# Altium schematic sheet USB_UART.SchDoc: USB2UART
size A4; Author: Tien Nguyen; Organization: Gremsy Co., Ltd; Address1: 22 Duong 18, Linh Dong; Address2: Thu Duc District, HCMC; DocumentNumber: 2; Revision: 1.2; SheetNumber: 2; SheetTotal: 5
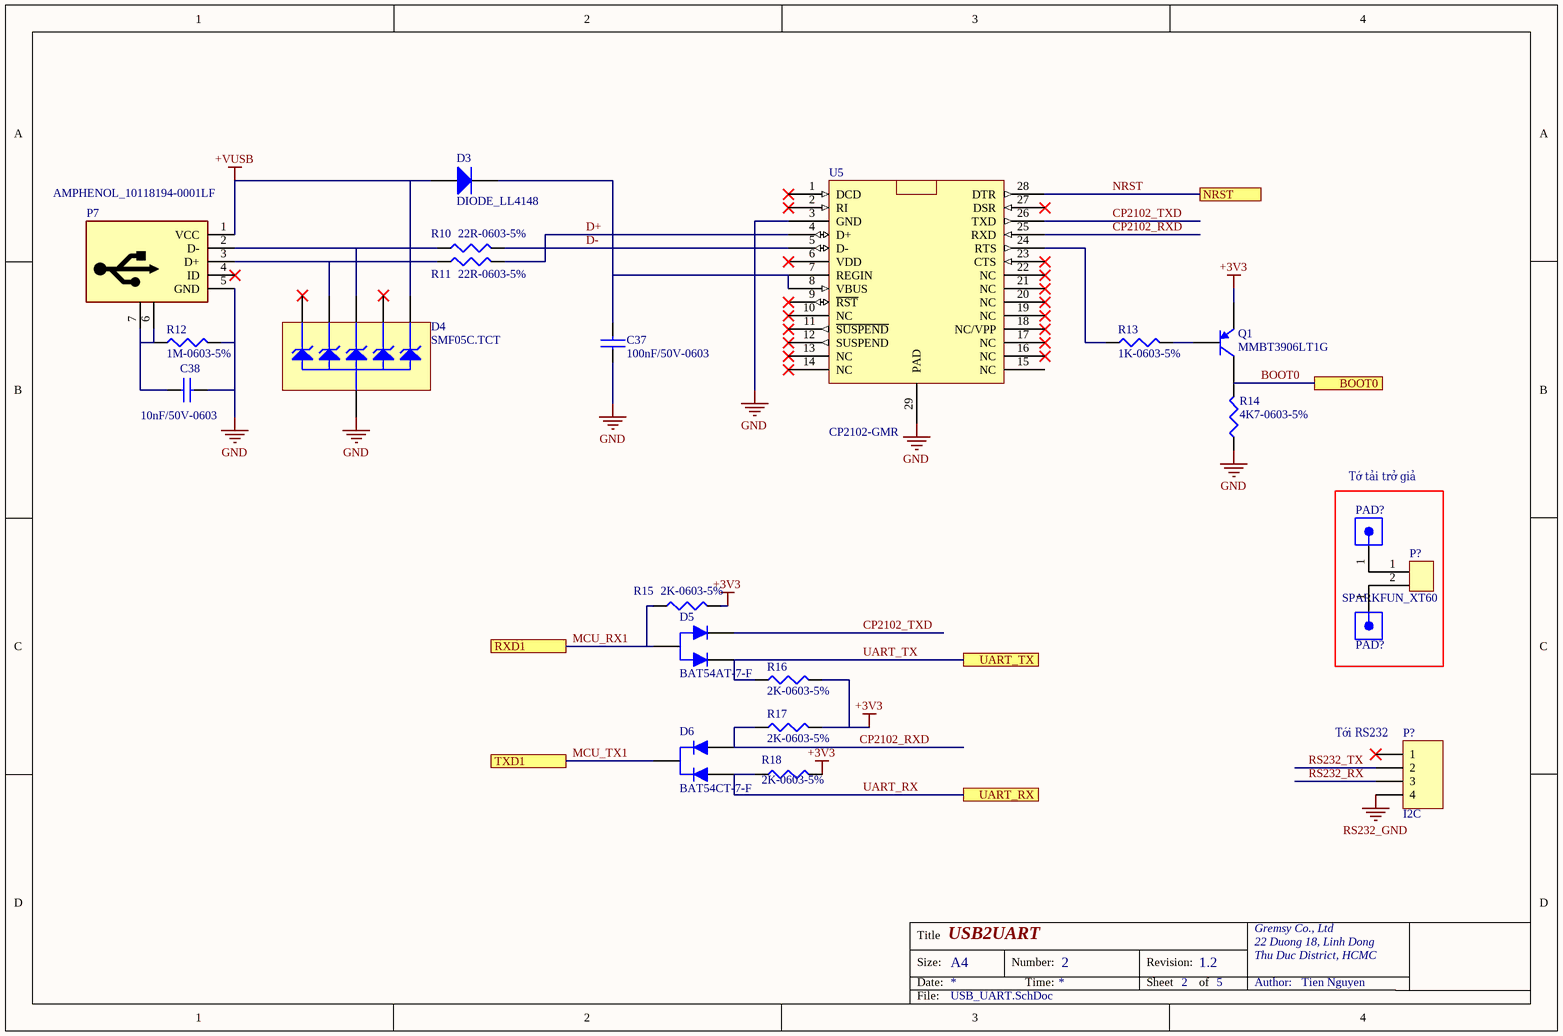
[diagram p0: USB_UART.SchDoc]

## Parts
(Parts that share a designator on the sheet are numbered #1, #2 ... from top to bottom, then left to right.)
C37  100nF/50V-0603  [CAP0603]
C38  10nF/50V-0603  [CAP0603]
D3  DIODE_LL4148  [SOD80]
D4  SMF05C.TCT  [SC-88]
D5  BAT54AT-7-F  [SOT523-3]
D6  BAT54CT-7-F  [SOT523-3]
P7  AMPHENOL_10118194-0001LF  [USB-B-Micro_10118194-0001LF]
P?#1  SPARKFUN_XT60  [XT60_MALE]
P?#2  I2C  [JST_SM04B-GHS-TB(LF)(SN)]
PAD?#1  PAD_2.5MM_1.5MM  [PAD_2.5MM_1.5MM_HOLE]  (value not drawn)  (no BOM)
PAD?#2  PAD_2.5MM_1.5MM  [PAD_2.5MM_1.5MM_HOLE]  (value not drawn)  (no BOM)
Q1  MMBT3906LT1G  [SOT23]
R10  22R-0603-5%  [RES0603]
R11  22R-0603-5%  [RES0603]
R12  1M-0603-5%  [RES0603]
R13  1K-0603-5%  [RES0603]
R14  4K7-0603-5%  [RES0603]
R15  2K-0603-5%  [RES0603]
R16  2K-0603-5%  [RES0603]
R17  2K-0603-5%  [RES0603]
R18  2K-0603-5%  [RES0603]
U5  CP2102-GMR  [QFN28-Pitch 0.5 mm]

## Blocks framed on the sheet
Tớ tải trở giả: P?#1 PAD?#1 PAD?#2

## Ports
BOOT0, NRST, RXD1, TXD1, UART_RX, UART_TX

## Nets
+3V3: Q1.2(E) R15.2 R16.2 R17.2 R18.2
+VUSB: D3.1(A) D4.6 P7.1(VCC)
GND: C37.1 C38.2 D4.2 P7.5(GND) R12.2 R14.1 U5.3(GND) U5.29(PAD)
RS232_GND: P?#2.4
BOOT0: Q1.3(C) R14.2 ; port BOOT0
CP2102_RXD: D6.2(A) R17.1 U5.25(RXD)
CP2102_TXD: D5.2(K) U5.26(TXD)
D+: R11.2 U5.4(D+)
D-: R10.2 U5.5(D-)
MCU_RX1: D5.3(A) R15.1 ; port RXD1
MCU_TX1: D6.3(K) ; port TXD1
NRST: U5.28(DTR) ; port NRST
RS232_RX: P?#2.3
RS232_TX: P?#2.2
UART_RX: D6.1(A) R18.1 ; port UART_RX
UART_TX: D5.1(K) R16.1 ; port UART_TX
NetC37_2: C37.2 D3.2(K) U5.7(REGIN) U5.8(VBUS)
NetC38_1: C38.1 P7.6(SHIELD) P7.7(SHIELD) R12.1
NetD4_3: D4.3 P7.3(D+) R11.1
NetD4_4: D4.4 P7.2(D-) R10.1
NetP?#1_1: P?#1.1 PAD?#1.1
NetP?#1_2: P?#1.2 PAD?#2.1
NetQ1_1: Q1.1(B) R13.2
NetR13_1: R13.1 U5.24(RTS)

Not connected (* = marked no-connect by the designer): D4 1* 5*; P7 4(ID)*; P?#2 1*; U5 1(DCD)* 2(RI)* 6(VDD)* 9(~{RST})* 10(NC)* 11(~{SUSPEND})* 12(SUSPEND)* 13(NC)* 14(NC)* 15(NC) 16(NC)* 17(NC)* 18(NC/VPP)* 19(NC)* 20(NC)* 21(NC)* 22(NC)* 23(CTS)* 27(DSR)*

## Notes on the sheet
- (near P?#2) Tới RS232
- Title
- Size:
- Date:
- A4
- Number:
- Time:
- Revision:
- Sheet
- of
- Author:
- File:

## Library data of the parts
C37 = CAP_100nF/50V-0603-10%: CAP CER 0.1UF 50V X7R 0603; Manufacturer 1: Yageo; MfrP/N: CC0603KRX7R9BB104; Tolerance: ±10%; Value: 100nF; GremsyP/N: 102-100n-005-0; Supplier 1: Digi-Key; Supplier Part Number 1: 311-1344-1-ND; Voltage - Rated: 50V; Package / Case: 0603 (1608 Metric); ComponentLink1URL: http://www.yageo.com/documents/recent/UPY-GPHC_X7R_6.3V-to-50V_18.pdf; ComponentLink1Description: http://www.yageo.com/documents/recent/UPY-GPHC_X7R_6.3V-to-50V_18.pdf
C38 = CAP_10nF/50V-0603-10%: CAP CER 10000PF 50V X7R 0603; Manufacturer 1: Yageo; MfrP/N: CC0603KRX7R9BB103; Tolerance: ±10%; Value: 10nF; GremsyP/N: 102-10n-0030; Supplier 1: Digi-Key; Supplier Part Number 1: 311-1085-1-ND; Voltage - Rated: 50V; Package / Case: 0603 (1608 Metric); ComponentLink1URL: http://www.yageo.com/documents/recent/UPY-GPHC_X7R_6.3V-to-50V_18.pdf; ComponentLink1Description: http://www.yageo.com/documents/recent/UPY-GPHC_X7R_6.3V-to-50V_18.pdf
D3 = DIODE-RECTIFIER_LL4148: DIODE GEN PURP 100V 200MA SOD80; Manufacturer: Fairchild/ON Semiconductor; MfrP/N: LL4148; Diode Type: Standard; Voltage - Forward (Vf) (Max) @ If: 1V @ 10mA; Speed: Small Signal =< 200mA (Io), Any Speed; Current - Reverse Leakage @ Vr: 25nA @ 20V; Capacitance @ Vr, F: 4pF @ 0V, 1MHz; GremsyP/N: 104-RECT-002-0; Supplier 1: Digi-Key; RoHS: RoHS Compliant; Category: Discrete Semiconductor Products; Stock 1: 494912; Pricing 1: 1=0.1, 10=0.095, 100=0.0518, 500=0.03188, 1000=0.02174 (USD); Packaging: Cut Tape (CT); Part Status: Active; Current - Average Rectified (Io): 200mA; Mounting Type: Surface Mount; Package / Case: DO-213AC, MINI-MELF, SOD-80; Supplier Device Package: SOD-80; Operating Temperature - Junction: -55°C ~ 175°C; ComponentLink1URL: https://www.fairchildsemi.com/datasheets/LL/LL4148.pdf; ComponentLink1Description: https://www.fairchildsemi.com/datasheets/LL/LL4148.pdf; Supplier Part Number 1: LL4148FSCT-ND
D4 = DIODE-ESD_SMF05C.TCT: TVS DIODE 5VWM 12.5VC SC70-6; Manufacturer 1: Semtech Corporation; Category 1: Circuit Protection; Type: Zener; Voltage - Reverse Standoff (Typ): 5V (Max); Voltage - Breakdown (Min): 6V; Voltage - Clamping (Max) @ Ipp: 12.5V; Current - Peak Pulse (10/1000µs): 8A (8/20µs); Power - Peak Pulse: 100W; Power Line Protection: No; Capacitance @ Frequency: 130pF @ 1MHz; GremsyP/N: 104-ESD-010-0; Supplier 1: Digi-Key; Supplier Part Number 1: SMF05CCT-ND; MfrP/N: SMF05C.TCT; RoHS 1: RoHS Compliant; Description 1: TVS DIODE 5VWM 12.5VC SC70-6; Stock 1: 35242; Pricing 1: 1=0.87, 10=0.757, 25=0.6704, 100=0.584, 250=0.50832, 500=0.4326, 1000=0.34608 (USD); Packaging: Cut Tape (CT); Part Status: Active; Applications: General Purpose; Operating Temperature: -55°C ~ 125°C (TJ); Mounting Type: Surface Mount; Package / Case: 6-TSSOP, SC-88, SOT-363; Supplier Device Package: SC-70-6; ComponentLink1URL: http://www.semtech.com/images/datasheet/smf05c.pdf; ComponentLink1Description: http://www.semtech.com/images/datasheet/smf05c.pdf; Manufacturer Part Number: SMF05C.TCT
D5 = DIODE-SCHOTTKY_BAT54AT-7-F: DIODE ARRAY SCHOTTKY 30V SOT523; Manufacturer: Diodes Incorporated; Diode Configuration: 1 Pair Common Anode; Current - Average Rectified (Io) (per Diode): 200mA (DC); Voltage - Forward (Vf) (Max) @ If: 1V @ 100mA; Speed: Small Signal =< 200mA (Io), Any Speed; Current - Reverse Leakage @ Vr: 2µA @ 25V; GremsyP/N: 104-SCKY-003-0; Supplier 1: Digi-Key; MfrP/N: BAT54AT-7-F; RoHS: RoHS Compliant; Category: Discrete Semiconductor Products; Stock 1: 38228; Pricing 1: 1=0.49, 10=0.363, 100=0.2053, 500=0.13596, 1000=0.10424 (USD); Packaging: Cut Tape (CT); Part Status: Active; Diode Type: Schottky; Operating Temperature - Junction: -65°C ~ 125°C; Mounting Type: Surface Mount; Package / Case: SOT-523; Supplier Device Package: SOT-523; ComponentLink1URL: https://www.diodes.com/assets/Datasheets/ds30259.pdf; ComponentLink1Description: https://www.diodes.com/assets/Datasheets/ds30259.pdf; Supplier Part Number 1: BAT54AT-FDICT-ND
D6 = DIODE-SCHOTTKY_BAT54CT-7-F: DIODE ARRAY SCHOTTKY 30V SOT523; Manufacturer: Diodes Incorporated; Diode Configuration: 1 Pair Common Cathode; Current - Average Rectified (Io) (per Diode): 200mA (DC); Voltage - Forward (Vf) (Max) @ If: 1V @ 100mA; Speed: Small Signal =< 200mA (Io), Any Speed; Current - Reverse Leakage @ Vr: 2µA @ 25V; GremsyP/N: 104-SCKY-006-0; Supplier 1: Digi-Key; MfrP/N: BAT54CT-7-F; RoHS: RoHS Compliant; Category: Discrete Semiconductor Products; Stock 1: 196325; Pricing 1: 1=0.49, 10=0.363, 100=0.2053, 500=0.13596, 1000=0.10424 (USD); Packaging: Cut Tape (CT); Part Status: Active; Diode Type: Schottky; Operating Temperature - Junction: -65°C ~ 125°C; Mounting Type: Surface Mount; Package / Case: SOT-523; Supplier Device Package: SOT-523; ComponentLink1URL: https://www.diodes.com/assets/Datasheets/ds30259.pdf; ComponentLink1Description: https://www.diodes.com/assets/Datasheets/ds30259.pdf; Supplier Part Number 1: BAT54CT-FDICT-ND
P7 = CON-AMPHENOL_10118194-0001LF: USB2.0 MICRO_5POS-RA-SMD-F-AM, FEMALE; Manufacturer 1: Amphenol FCI; Description 1: CONN USB MICRO B RECPT SMT R/A; Category 1: Connectors, Interconnects; Connector Type: USB - micro B; Number of Contacts: 5; Gender: Receptacle; GremsyP/N: 106-AMPHENOL-008; Number of Ports: 1; Current Rating: 1.8A per Contact; Voltage - Rated: 100VAC; Shielding: Shielded; Supplier 1: Digi-Key; Supplier Part Number 1: 609-4618-1-ND; MfrP/N: 10118194-0001LF; RoHS 1: RoHS Compliant; Stock 1: 208581; Pricing 1: 1=0.46, 10=0.437, 25=0.3744, 50=0.318, 100=0.3056, 250=0.27444, 500=0.26196 (USD); Packaging: Cut Tape (CT); Part Status: Active; Specifications: USB 2.0; Mounting Type: Surface Mount, Right Angle; Through Hole; Mounting Feature: Horizontal; Termination: Solder; Features: Solder Retention; Operating Temperature: -30°C ~ 80°C; Contact Finish: Gold; Shell/Shielding Material: Steel, Stainless; ComponentLink1URL: http://portal.fciconnect.com/Comergent//fci/drawing/10118194.pdf; ComponentLink1Description: http://portal.fciconnect.com/Comergent//fci/drawing/10118194.pdf
P?#1 = CON-SPARKFUN_XT60: CON XT-60, MALE PIN, THROUGH HOLE, 500V, 30A; Manufacturer: SparkFun Electronics; GremsyP/N: 106-SPARKFUN-001; MfrP/N: XT-60
P?#2 = CON-JST_SM04B-GHS-TB(LF)(SN): WTB-GH_4POS-P1.25-RA-SMD; Manufacturer: JST Sales America Inc.; Connector Type: Header; Pitch - Mating: 0.049" (1.25mm); Style: Board to Cable/Wire; Shrouding: Shrouded - 4 Wall; Number of Positions: 4; Number of Positions Loaded: All; Material Flammability Rating: UL94 V-0; Current Rating: 1A; Voltage Rating: 50V; Mated Stacking Heights: 4.35mm; GremsyP/N: 106-JST-044; Supplier 1: Digi-Key; MfrP/N: SM04B-GHS-TB(LF)(SN); RoHS: RoHS Compliant; Category: Connectors, Interconnects; Stock 1: 111522; Pricing 1: 1=0.45, 10=0.423, 100=0.3244, 500=0.28212, 1000=0.23274 (USD); Packaging: Cut Tape (CT); Part Status: Active; Contact Type: Outer Shroud Contact; Number of Rows: 1; Row Spacing - Mating: -; Mounting Type: Surface Mount, Right Angle; Termination: Solder; Fastening Type: Locking Ramp; Contact Length - Mating: -; Contact Length - Post: -; Overall Contact Length: -; Insulation Height: 0.167" (4.25mm); Contact Shape: Rectangular; Contact Finish - Mating: Tin; Contact Finish Thickness - Mating: -; Contact Finish - Post: Tin; Contact Material: Phosphor Bronze; Insulation Material: Polyamide (PA9T), Nylon 9T; Features: Solder Retention; Operating Temperature: -25°C ~ 85°C; Ingress Protection: -; Insulation Color: Natural; Contact Finish Thickness - Post: -; Applications: -; ComponentLink1URL: http://www.jst-mfg.com/product/pdf/eng/eGH.pdf; ComponentLink1Description: http://www.jst-mfg.com/product/pdf/eng/eGH.pdf; Supplier Part Number 1: 455-1566-1-ND
PAD?#1 PAD?#2 = PAD_2.5MMC_1.5MMD_HOLE
Q1 = TRNS-PNP_MMBT3906LT1G: TRANS PNP 40V 0.2A SOT23; Manufacturer 1: ON Semiconductor; Manufacturer Size Code: A; Category 1: Discrete Semiconductor Products; Current - Collector (Ic) (Max): 200mA; Vce Saturation (Max) @ Ib, Ic: 400mV @ 5mA, 50mA; DC Current Gain (hFE) (Min) @ Ic, Vce: 100 @ 10mA, 1V; Power - Max: 300mW; Frequency - Transition: 250MHz; Description 2: CAP TANT 10UF 10V 10% 1206; Category 2: Capacitors; Capacitance: 10µF; Tolerance: ±10%; Voltage - Rated: 10V; Type: Molded; ESR (Equivalent Series Resistance): 2 Ohm; GremsyP/N: 109-PNP-001-0; Supplier 1: Digi-Key; Supplier Part Number 1: MMBT3906LT1GOSDKR-ND; MfrP/N: MMBT3906LT1G; RoHS 1: RoHS Compliant; Description 1: TRANS PNP 40V 0.2A SOT23; Stock 1: 104972; Pricing 1: 1=0.11, 10=0.105, 100=0.0569, 500=0.03504, 1000=0.02389 (USD); Packaging: Digi-Reel®; Part Status: Active; Transistor Type: PNP; Voltage - Collector Emitter Breakdown (Max): 40V; Current - Collector Cutoff (Max): -; Operating Temperature: -55°C ~ 150°C (TJ); Mounting Type: Surface Mount; Package / Case: TO-236-3, SC-59, SOT-23-3; Supplier Device Package: SOT-23-3 (TO-236); ComponentLink1URL: http://www.onsemi.com/pub_link/Collateral/MMBT3906LT1-D.PDF; ComponentLink1Description: http://www.onsemi.com/pub_link/Collateral/MMBT3906LT1-D.PDF; Supplier 2: Digi-Key; Supplier Part Number 2: 718-1969-1-ND; Manufacturer 2: Vishay Sprague; Manufacturer Part Number 2: 593D106X9010A2TE3; RoHS 2: RoHS Compliant; Stock 2: 5789; Pricing 2: 1=0.5, 10=0.344, 100=0.2065, 500=0.15486, 1000=0.13077 (USD); Lifetime @ Temp.: -; Size / Dimension: 0.126" L x 0.063" W (3.20mm x 1.60mm); Height - Seated (Max): 0.071" (1.80mm); Lead Spacing: -; Features: General Purpose; Failure Rate: -; ComponentLink2URL: http://www.vishay.com/docs/40005/593d.pdf; ComponentLink2Description: http://www.vishay.com/docs/40005/593d.pdf; Manufacturer Part Number: MMBT3906LT1G
R10 R11 = RES_22R-0603-5%: RES 22 OHM 5% 1/10W 0603; Manufacturer 1: Yageo; MfrP/N: RC0603JR-0722RL; Value: 22R; GremsyP/N: 101-22R-002-0; Supplier 1: Digi-Key; Supplier Part Number 1: 311-22GRCT-ND; Package / Case: 0603 (1608 Metric); Tolerance: ±5%
R12 = RES_1M-0603-5%: RES 1M OHM 5% 1/10W 0603; Manufacturer 1: Yageo; MfrP/N: RC0603JR-071ML; GremsyP/N: 101-1M-002-0; Supplier 1: Digi-Key; Supplier Part Number 1: 311-1.0MGRCT-ND; Resistance (Ohms): 1M; Tolerance: ±5%; Package / Case: 0603 (1608 Metric); ComponentLink1URL: http://www.yageo.com/documents/recent/PYu-RC_Group_51_RoHS_L_7.pdf; ComponentLink1Description: http://www.yageo.com/documents/recent/PYu-RC_Group_51_RoHS_L_7.pdf; Value: 1M
R13 = RES_1K-0603-5%: RES 1K OHM 5% 1/10W 0603; Manufacturer 1: Yageo; MfrP/N: RC0603JR-071KL; GremsyP/N: 101-1K-003-0; Supplier 1: Digi-Key; Supplier Part Number 1: 311-1.0KGRCT-ND; Resistance (Ohms): 1k; Tolerance: ±5%; Package / Case: 0603 (1608 Metric); ComponentLink1URL: http://www.yageo.com/documents/recent/PYu-RC_Group_51_RoHS_L_7.pdf; ComponentLink1Description: http://www.yageo.com/documents/recent/PYu-RC_Group_51_RoHS_L_7.pdf; Value: 1K
R14 = RES_4K7-0603-5%: RES 4.7K OHM 5% 1/10W 0603; Manufacturer: Yageo; MfrP/N: RC0603JR-074K7L; Value: 4K7; GremsyP/N: 101-4K7-002-0; Supplier 1: Digi-Key; Tolerance: ±5%; Package / Case: 0603 (1608 Metric); ComponentLink1URL: http://www.yageo.com/documents/recent/PYu-RC_Group_51_RoHS_L_7.pdf; ComponentLink1Description: http://www.yageo.com/documents/recent/PYu-RC_Group_51_RoHS_L_7.pdf; Supplier Part Number 1: 311-4.7KGRCT-ND
R15-R18 = RES_2K-0603-5%: RES 2K OHM 5% 1/10W 0603; Manufacturer 1: Yageo; MfrP/N: RC0603JR-072KL; GremsyP/N: 101-2K-002-0; Supplier 1: Digi-Key; Supplier Part Number 1: 311-2.0KGRCT-ND; Resistance (Ohms): 2k; Tolerance: ±5%; Package / Case: 0603 (1608 Metric); ComponentLink1URL: http://www.yageo.com/documents/recent/PYu-RC_Group_51_RoHS_L_7.pdf; ComponentLink1Description: http://www.yageo.com/documents/recent/PYu-RC_Group_51_RoHS_L_7.pdf; Value: 2K
U5 = CP2102-GMR: IC USB-TO-UART BRIDGE 28VQFN; Manufacturer 1: Silicon Labs; Category 1: Integrated Circuits (ICs); Protocol: USB; Function: Bridge, USB to UART; Interface: UART; Standards: USB 2.0; Voltage - Supply: 3 V ~ 3.6 V; Current - Supply: 20mA; Supplier 1: Digi-Key; Supplier Part Number 1: 336-1160-1-ND; Manufacturer Part Number 1: CP2102-GMR; RoHS 1: RoHS Compliant; Description 1: IC USB-TO-UART BRIDGE 28VQFN; Stock 1: 39071; Pricing 1: 1=2.88, 25=2.7736, 100=2.6668 (USD); Packaging: Cut Tape (CT); Part Status: Active; Operating Temperature: -40°C ~ 85°C; Package / Case: 28-VFQFN Exposed Pad; Supplier Device Package: 28-QFN (5x5); ComponentLink1URL: http://www.silabs.com/documents/public/data-sheets/CP2102-9.pdf; ComponentLink1Description: http://www.silabs.com/documents/public/data-sheets/CP2102-9.pdf